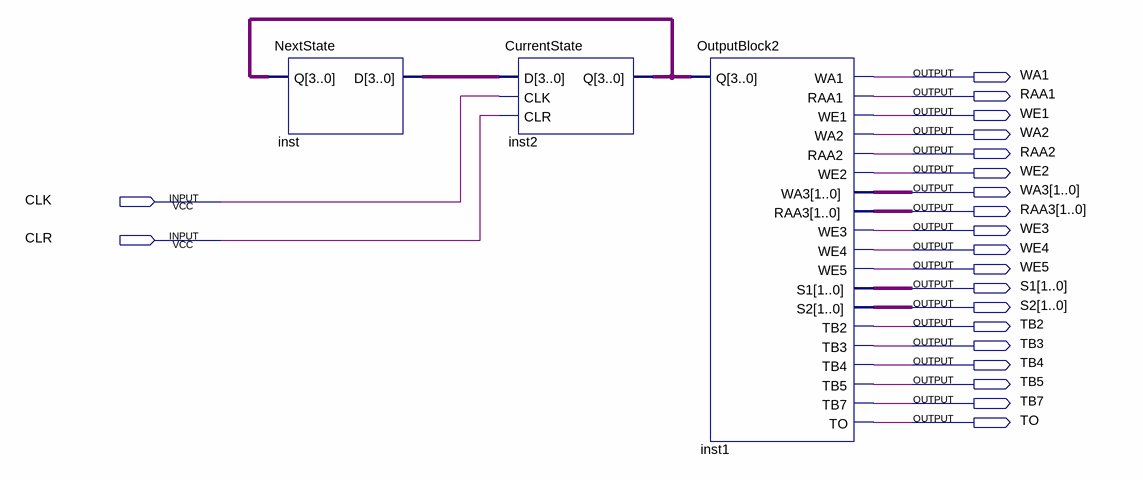
[diagram p0: schematic sheet]
// Quartus schematic Control.bdf as structural Verilog: 3 symbols, 21 pins
module Control (
  input  CLK,
  input  CLR,
  output WA1,
  output RAA1,
  output WE1,
  output WA2,
  output RAA2,
  output WE2,
  output [1:0] WA3,
  output [1:0] RAA3,
  output WE3,
  output WE4,
  output WE5,
  output [1:0] S1,
  output [1:0] S2,
  output TB2,
  output TB3,
  output TB4,
  output TB5,
  output TB7,
  output TO
);

  wire [3:0] inst2_q, inst_d;

  NextState inst (.Q(inst2_q), .D(inst_d));
  CurrentState inst2 (.D(inst_d), .CLK(CLK), .CLR(CLR), .Q(inst2_q));
  OutputBlock2 inst1 (
    .Q(inst2_q), .WA1(WA1), .RAA1(RAA1), .WE1(WE1), .WA2(WA2), .RAA2(RAA2), .WE2(WE2), .WA3(WA3),
    .RAA3(RAA3), .WE3(WE3), .WE4(WE4), .WE5(WE5), .S1(S1), .S2(S2), .TB2(TB2), .TB3(TB3), .TB4(TB4),
    .TB5(TB5), .TB7(TB7), .TO(TO));
endmodule
